# EasyEDA Pro project ProPrj_Embedded Tools_2024-11-02.epro, board Communication
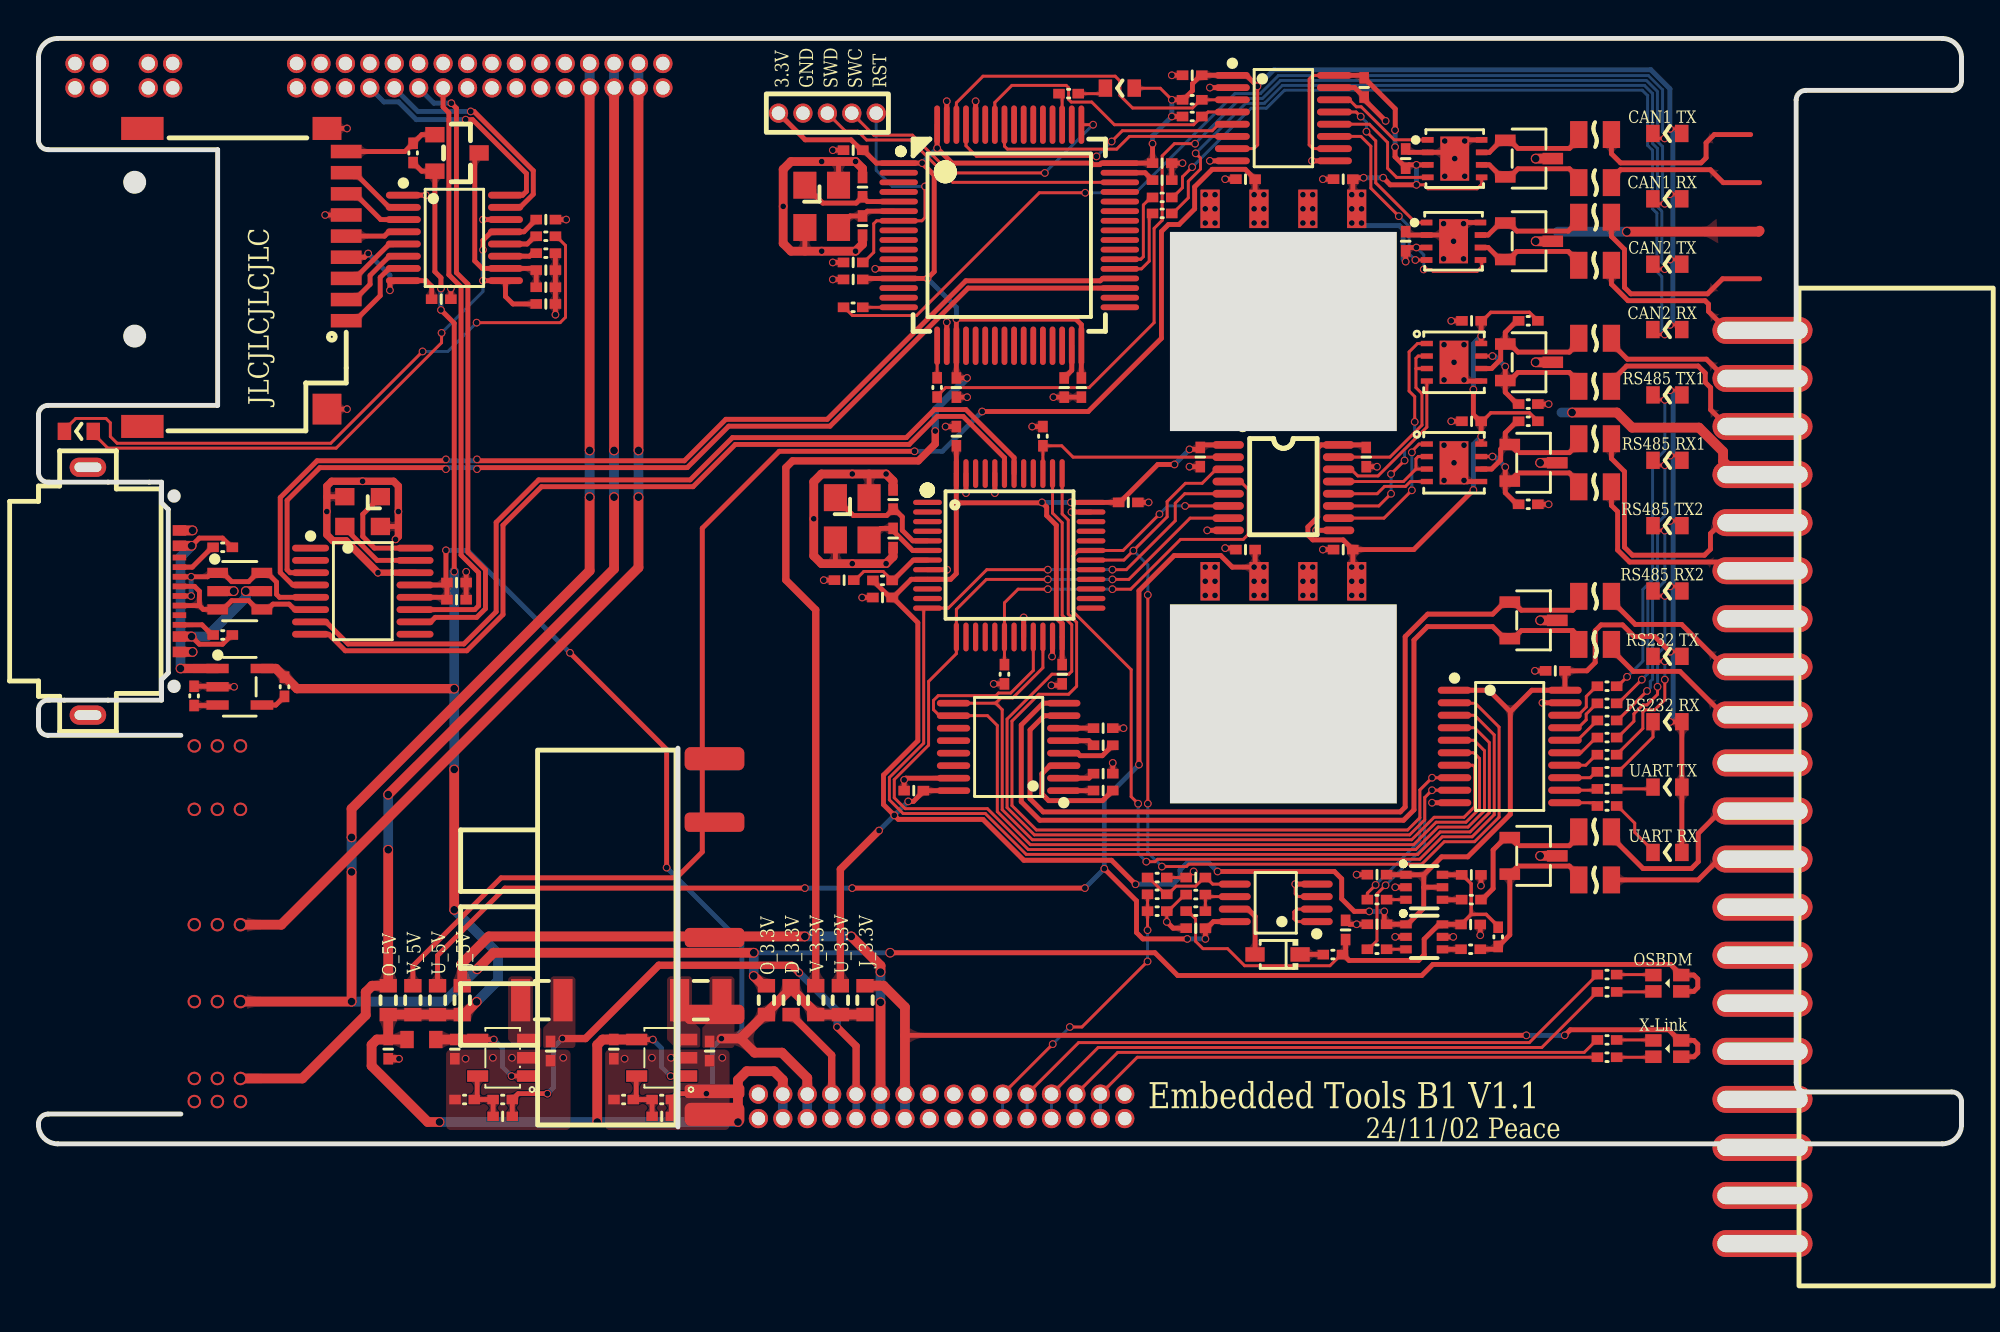
[diagram p11: board, top side]
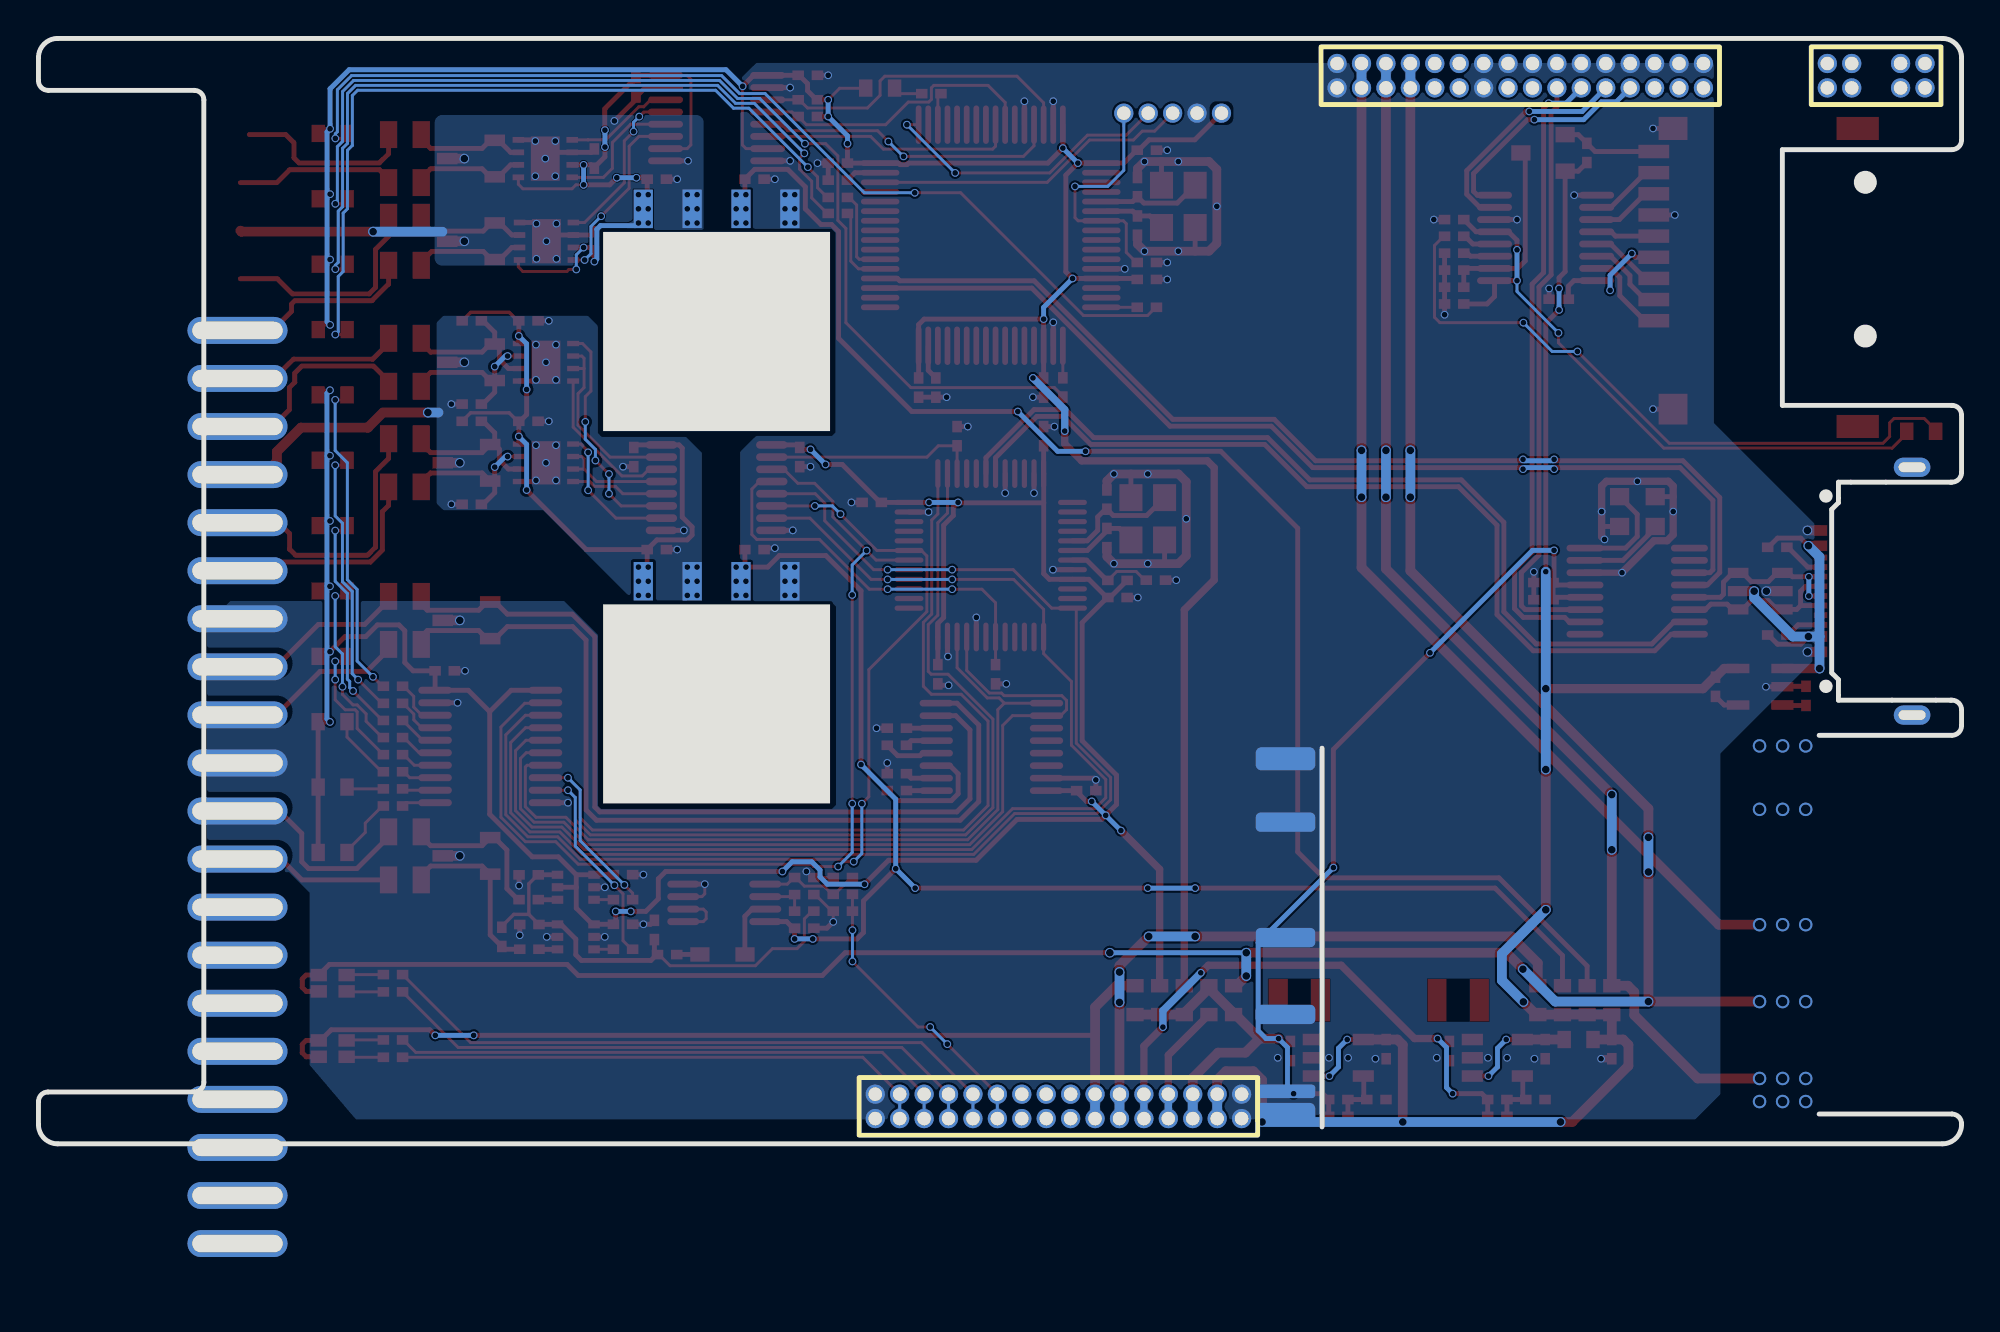
[diagram p12: board, bottom side, seen from below]

Outline 100 x 57.5 mm; copper layers: Top Layer, Bottom Layer. Coordinates in mm from the lower left corner of the outline.
Outline path: 7.4,21.25 0.5,21.25 arc(0.15,21.4) 0,21.75 0,22.58 arc(0.15,22.93) 0.5,23.08 0.57,23.08 ; 7.4,1.55 0.5,1.55 arc(0.15,1.4) 0,1.05 0,1 arc(0.29,0.29) 1,0 99,0 arc(99.71,0.29) 100,1 100,2.2 arc(99.85,2.55) 99.5,2.7 91.9,2.7 arc(91.55,2.85) 91.4,3.2 91.4,54.3 arc(91.55,54.65) 91.9,54.8 99.5,54.8 arc(99.85,54.95) 100,55.3 100,56.5 arc(99.71,57.21) 99,57.5 1,57.5 arc(0.29,57.21) 0,56.5 0,52.21 arc(0.15,51.86) 0.5,51.71 9.32,51.71 9.32,38.41 0.5,38.41 arc(0.15,38.27) 0,37.91 0,34.92 arc(0.15,34.57) 0.5,34.42 0.57,34.42
Stack: Top Layer 0.035mm / Dielectric1 1.51mm FR4 er 4.5 / Bottom Layer 0.035mm

## Design rules (mm)
template: 双面板
spacing copperThickness1oz (default): track to track 0.102, other pairs 0.102 to 0.201
spacing copperThickness2oz: track to track 0.203, other pairs 0.152 to 0.3
track width copperThickness1oz (default): min 0.102, default 0.254, max 2.54
track width copperThickness2oz: min 0.203, default 0.254, max 2.54
differential pair differentialPair (default): width min 0.127, default 0.254, max 2.54; gap min 0.152, default 0.152
via viaSize (default): diameter min 0.399, default 0.399, max 10; hole min 0.3, default 0.3, max 6.299

## Placement (name value [footprint] x y rotation side)
B1  600R@100MHz  [L0603]  19.91 5.43 0 top
C1  100nF  [C0402]  42.36 51.69 0 top
C2  2.2uF  [C0402]  47.73 39.34 270 top
C3  100nF  [C0402]  54.23 39.34 90 top
C4  100nF  [C0402]  58.43 51.02 180 top
C5  100nF  [C0402]  42.36 44.96 0 top
C6  2.2uF  [C0402]  58.43 50.13 180 top
C7  10pF  [C0402]  42.85 49.77 90 top
C8  10pF  [C0402]  42.85 47.77 90 top
C9  2.2uF  [C0402]  53.34 39.34 90 top
C10  100nF  [C0402]  42.36 45.85 180 top
C11  100nF  [C0402]  59.99 55.58 0 top
C12  100nF  [C0402]  71.09 51.25 90 top
C13  100nF  [C0402]  71.09 46.95 90 top
C14  100nF  [C0402]  68.94 54.95 270 top
C15  4.7uF  [C0402]  62.77 50.18 0 top
C16  10uF  [C0402]  67.85 50.18 0 top
C17  10pF  [C0402]  44.44 31.51 90 top
C18  10pF  [C0402]  44.44 33.51 90 top
C19  100nF  [C0402]  78.88 24.61 0 top
C20  100nF  [C0402]  43.89 28.42 0 top
C21  100nF  [C0402]  53.23 24.43 90 top
C22  100nF  [C0402]  41.89 29.32 0 top
C23  100nF  [C0402]  56.67 33.37 180 top
C24  100nF  [C0402]  47.73 36.81 270 top
C25  100nF  [C0402]  60.41 35.73 90 top
C26  4.7uF  [C0402]  62.77 30.91 0 top
C27  100nF  [C0402]  55.36 18.38 0 top
C28  100nF  [C0402]  55.36 19.26 0 top
C29  100nF  [C0402]  55.36 20.73 180 top
C30  100nF  [C0402]  55.36 21.62 0 top
C31  10uF  [C0402]  67.85 30.91 0 top
C32  100nF  [C0402]  60.18 13.85 0 top
C33  100nF  [C0402]  69.04 35.72 270 top
C34  100nF  [C0402]  69.6 14 0 top
C35  100nF  [C0402]  69.6 11.42 0 top
C36  100nF  [C0402]  45.52 18.37 180 top
C37  100nF  [C0402]  74.51 13.99 180 top
C38  100nF  [C0402]  74.47 11.41 180 top
C39  2.2uF  [C0402]  67.97 11.13 270 top
C40  100nF  [C0402]  74.52 42.81 180 top
C41  100nF  [C0402]  74.52 37.59 180 top
C42  100nF  [C0402]  60.18 11.22 180 top
C43  10uF  [C0402]  26.38 44.56 180 top
C44  100nF  [C0402]  26.38 45.45 0 top
C45  10uF  [C0402]  26.38 48.08 180 top
C46  100nF  [C0402]  26.38 43.69 0 top
C47  100nF  [C0402]  20.95 43.94 180 top
C48  10uF  [C0402]  21.74 29.2 180 top
C49  100nF  [C0402]  21.74 28.3 180 top
C50  100nF  [C0402]  18.19 4.93 90 top
C51  4.7uF  [C0402]  29.92 4.93 90 top
C52  4.7uF  [C0402]  21.65 4.93 90 top
C53  10pF  [C0402]  32.41 1.43 0 top
C54  10pF  [C0402]  24.14 1.43 0 top
C55  10uF  [C0402]  34.9 4.83 90 top
C56  10uF  [C0402]  26.63 4.83 90 top
CARD1  TF PUSH  [TF-SMD_TF-PUSH]  10.7 45.07 270 top
CN1  KF2EDGV-2.5-20P  [CONN-TH_20P-P2.50_KF2EDGV-2.5-20P_SMD]  89.5 28.75 0 top
D1  SM712  [SOT-23-3_L2.9-W1.6-P1.90-LS2.8-BR]  77.51 51.25 180 top
D2  SM712  [SOT-23-3_L2.9-W1.6-P1.90-LS2.8-BR]  77.51 46.95 180 top
D3  1N5819WS  [SOD-323_L1.8-W1.3-LS2.5-RD]  64.43 9.85 180 top
D4  USBLC6-2SC6  [SOT-23-6_L2.9-W1.6-P0.95-LS2.8-BL]  10.47 28.75 270 top
D5  -  [LED1615]  84.7 8.35 0 top
D6  -  [LED1615]  84.7 4.95 0 top
F1  fe1784bef1244946a9952536cf903c7f  [F0805]  80.94 52.5 0 top
F2  fe1784bef1244946a9952536cf903c7f  [F0805]  80.94 50 0 top
F3  fe1784bef1244946a9952536cf903c7f  [F0805]  80.94 48.2 0 top
F4  fe1784bef1244946a9952536cf903c7f  [F0805]  80.94 45.7 0 top
F5  fe1784bef1244946a9952536cf903c7f  [F0805]  80.94 25.98 0 top
F6  fe1784bef1244946a9952536cf903c7f  [F0805]  80.94 28.48 0 top
F7  fe1784bef1244946a9952536cf903c7f  [F0805]  80.94 16.23 0 top
F8  fe1784bef1244946a9952536cf903c7f  [F0805]  80.94 13.73 0 top
F9  fe1784bef1244946a9952536cf903c7f  [F0805]  80.94 39.41 0 top
F10  fe1784bef1244946a9952536cf903c7f  [F0805]  80.94 41.91 0 top
F11  fe1784bef1244946a9952536cf903c7f  [F0805]  80.94 34.18 0 top
F12  fe1784bef1244946a9952536cf903c7f  [F0805]  80.94 36.68 0 top
L1  2.2uH  [IND-SMD_L2.5-W2.0_MHCHL2520]  34.44 7.47 0 top
L2  2.2uH  [IND-SMD_L2.5-W2.0_MHCHL2520]  26.17 7.47 0 top
LED1  BLUE  [LED0603]  84.7 52.55 0 top
LED2  YELLOW  [LED0603]  84.7 49.15 0 top
LED3  BLUE  [LED0603]  84.7 45.75 0 top
LED4  YELLOW  [LED0603]  84.7 42.35 0 top
LED5  WHITE  [LED0603]  56.23 54.91 0 top
LED6  BLUE  [LED0603]  84.71 38.95 0 top
LED7  YELLOW  [LED0603]  84.71 35.55 0 top
LED8  BLUE  [LED0603]  84.71 32.15 0 top
LED9  YELLOW  [LED0603]  84.71 28.75 0 top
LED10  BLUE  [LED0603]  84.71 25.35 0 top
LED11  YELLOW  [LED0603]  84.71 21.95 0 top
LED12  BLUE  [LED0603]  84.71 18.55 0 top
LED13  YELLOW  [LED0603]  84.71 15.15 0 top
LED14  WHITE  [LED0603]  2.1 37.05 0 top
NOREF  -  [Pad_e1749]  68.55 29.27 0 top
NOREF#2  -  [Pad_e734]  66.01 48.64 0 top
NOREF#3  -  [Pad_e1746]  60.93 29.27 0 top
NOREF#4  -  [Pad_e735]  68.55 48.64 0 top
NOREF#5  -  [Pad_e1747]  63.47 29.27 0 top
NOREF#6  -  [Pad_e1748]  66.01 29.27 0 top
NOREF#7  -  [Pad_e733]  63.47 48.64 0 top
NOREF#8  -  [Pad_e732]  60.93 48.64 0 top
P1  dc5cb5f8908149b6a9bd9e7172c1ed3e  [HDR-TH_5P-P1.27-V-M]  41.02 53.61 0 top
P2  BX-PM1.27-2-5PU  [HDR-TH_10P-P1.27-V-F-R2-C5-S1.27_1]  4.44 55.56 0 bottom
P3  27a93d4c6a1a4b3c8a68780d97aa3357  [HDR-TH_32P-P1.27-V-F-R2-C16-S1.27]  46.96 1.95 0 bottom
P4  27a93d4c6a1a4b3c8a68780d97aa3357  [HDR-TH_32P-P1.27-V-F-R2-C16-S1.27]  22.95 55.56 0 bottom
Q1  AO3401A  [SOT-23_L2.9-W1.3-P1.90-LS2.4-BR]  21.76 51.55 180 top
R1  1K  [R0402]  42.36 43.52 180 top
R2  1K  [R0402]  46.73 39.35 270 top
R3  1K  [R0402]  58.43 48.4 0 top
R4  1K  [R0402]  58.43 49.23 0 top
R5  1K  [R0402]  53.57 54.63 0 top
R6  100K  [R0402]  59.99 54.31 180 top
R7  100K  [R0402]  59.99 53.44 180 top
R8  10K  [R0402]  43.89 29.31 180 top
R9  1K  [R0402]  81.57 23.8 180 top
R10  1K  [R0402]  81.57 22.91 180 top
R11  1K  [R0402]  81.57 22.02 180 top
R12  1K  [R0402]  81.57 21.13 180 top
R13  1K  [R0402]  81.57 20.24 180 top
R14  1K  [R0402]  81.57 19.35 180 top
R15  1K  [R0402]  81.57 18.46 180 top
R16  1K  [R0402]  81.57 17.57 180 top
R17  100K  [R0402]  52.23 36.81 270 top
R18  100K  [R0402]  50.23 24.43 90 top
R19  1K  [R0402]  58.17 12.1 0 top
R20  10K  [R0402]  58.17 12.98 0 top
R21  100K  [R0402]  58.17 13.85 0 top
R22  220R  [R0402]  69.6 12.7 0 top
R23  220R  [R0402]  69.6 10.12 0 top
R24  10K  [R0402]  60.18 12.1 0 top
R25  10K  [R0402]  60.18 12.97 180 top
R26  100R  [R0402]  74.51 12.7 0 top
R27  100R  [R0402]  74.47 10.12 0 top
R28  100R  [R0402]  67.31 9.85 180 top
R29  10K  [R0402]  75.9 10.77 270 top
R30  10K  [R0402]  77.47 42.81 0 top
R31  10K  [R0402]  77.47 38.48 180 top
R32  10K  [R0402]  77.47 37.59 0 top
R33  10K  [R0402]  77.47 33.27 180 top
R34  100K  [R0402]  19.48 51.55 270 top
R35  1K  [R0402]  26.38 46.33 0 top
R36  1K  [R0402]  26.38 47.21 0 top
R37  100K  [R0402]  32.41 2.31 0 top
R38  22K  [R0402]  30.43 2.31 0 top
R39  200K  [R0402]  24.14 2.31 0 top
R40  100K  [R0402]  22.16 2.31 0 top
R41  56K  [R0402]  9.58 26.47 180 top
R42  56K  [R0402]  9.58 31.03 180 top
R43  100K  [R0402]  12.79 23.78 90 top
R44  12K  [R0402]  8.09 23.3 270 top
R45  0R  [R0603]  19.47 7.47 270 top
R46  0R  [R0603]  40.42 7.47 270 top
R47  0R  [R0603]  20.75 7.47 270 top
R48  0R  [R0603]  41.7 7.47 270 top
R49  0R  [R0603]  18.19 7.47 270 top
R50  0R  [R0603]  37.86 7.47 270 top
R51  0R  [R0603]  22.03 7.47 270 top
R52  0R  [R0603]  42.98 7.47 270 top
R53  0R  [R0603]  39.14 7.47 90 top
R54  1K  [R0402]  81.57 7.9 180 top
R55  1K  [R0402]  81.57 8.81 180 top
R56  1K  [R0402]  81.57 4.5 180 top
R57  1K  [R0402]  81.57 5.41 180 top
SW1  SS23H37L4  [SW-TH_SS23H37LX_SMD]  9.3 11.4 0 top
U1  SIT1057TK/3  [DFN-8_L3.0-W3.0-P0.65-BL-EP-1]  73.65 51.25 270 top
U2  SIT1057TK/3  [DFN-8_L3.0-W3.0-P0.65-BL-EP-1]  73.58 46.95 270 top
U3  CA-IS3742HB  [SSOP-16_L4.9-W3.9-P0.64-LS6.0-BL]  64.74 53.36 270 top
U4  B0505S-1WR3  [PWRM-TH_B0503S-1WR2_S_1]  64.74 47.49 0 top
U5  74HC245KAJ  [TSSOP-20_L6.5-W4.4-P0.65-LS6.4-BL]  76.5 20.67 270 top
U6  CH344Q  [LQFP-48_L7.0-W7.0-P0.50-LS9.0-BL]  50.48 30.62 270 top
U7  CA-IS3762HB  [SSOP-16_L4.9-W3.9-P0.64-LS6.0-BL-1]  64.74 34.13 270 top
U8  B0505S-1WR3  [PWRM-TH_B0503S-1WR2_S_1]  64.74 28.11 0 top
U9  SP3232EEY-L/TR  [TSSOP-16_L5.0-W4.4-P0.65-LS6.4-BL]  50.45 20.65 90 top
U10  74LVC1T45DW-7  [SC-70-6_L2.2-W1.3-P0.65-LS2.1-BR]  72.06 13.35 180 top
U11  74LVC1T45DW-7  [SC-70-6_L2.2-W1.3-P0.65-LS2.1-BR]  72.06 10.77 180 top
U12  SIT3088ETK  [DFN-8_L3.0-W3.0-P0.65-BL-EP]  73.61 40.66 270 top
U13  SIT3088ETK  [DFN-8_L3.0-W3.0-P0.65-BL-EP]  73.61 35.43 270 top
U14  SDT23C712L02  [SOT-23-3_L2.9-W1.6-P1.90-LS2.8-BR]  77.74 27.23 180 top
U15  ESDA5V3L  [SOT-23-3_L2.9-W1.6-P1.90-LS2.8-BR]  77.74 14.98 180 top
U16  SM712  [SOT-23-3_L2.9-W1.6-P1.90-LS2.8-BR]  77.51 40.66 180 top
U17  SM712  [SOT-23-3_L2.9-W1.6-P1.90-LS2.8-BR]  77.74 35.43 180 top
U18  GL823K-HCY04  [SSOP-16_L4.9-W3.9-P0.64-LS6.0-BL]  21.63 47.13 270 top
U19  CH334R  [QSOP-16_L4.9-W3.9-P0.64-LS6.0-BL]  16.87 28.75 270 top
U20  TLV62568DBVR  [SOT-23-5_L3.0-W1.7-P0.95-LS2.8-BR]  32.41 4.48 0 top
U21  TLV62568DBVR  [SOT-23-5_L3.0-W1.7-P0.95-LS2.8-BR]  24.14 4.48 0 top
U22  SY6280AAC  [SOT-23-5_L3.0-W1.7-P0.95-LS2.8-BL]  10.47 23.78 270 top
U23  STM32F405RGT6  [LQFP-64_L10.0-W10.0-P0.50-LS12.0-BL]  50.48 47.27 270 top
U24  LMV358AIDGKR  [VSSOP-8_L3.0-W3.0-P0.65-LS5.0-BL]  64.34 12.54 90 top
USB1  USB31-TYPEC-16X7C-1FS  [USB-SMD_USB31-TYPEC-16X7C-1FS]  4.95 28.75 270 top
X1  8MHz  [CRYSTAL-SMD_4P-L3.2-W2.5-BL-A]  40.73 48.77 270 top
X2  8MHz  [CRYSTAL-SMD_4P-L3.2-W2.5-BL-A]  42.32 32.51 270 top
X3  12MHz  [CRYSTAL-SMD_4P-L2.5-W2.0-BL-A]  16.85 32.89 180 top

## Footprints (pads in the part's own frame, mm; a bottom-side part is the same pattern mirrored in y, then rotated)
C0402
  rect 0.6x0.5 smd: 1(-0.5,0) 2(0.5,0)
CONN-TH_20P-P2.50_KF2EDGV-2.5-20P_SMD
  oval 5.2x1.4 hole 4.7x0.9: 1(0.15,13.563) 2(0.15,11.063) 3(0.15,8.563) 4(0.15,6.063) 5(0.15,3.563) 6(0.15,1.063) 7(0.15,-1.437) 8(0.15,-3.937) 9(0.15,-6.437) 10(0.15,-8.937) 11(0.15,-11.437) 12(0.15,-13.937) 13(0.15,-16.437) 14(0.15,-18.937) 15(0.15,-21.437) 16(0.15,-23.937) 17(0.15,-26.437) 18(0.15,-28.937) 19(0.15,-31.437) 20(0.15,-33.937)
CRYSTAL-SMD_4P-L2.5-W2.0-BL-A
  rect 1x0.9 smd: 1(-0.925,-0.775) 2(0.925,-0.775) 3(0.925,0.775) 4(-0.925,0.775)
CRYSTAL-SMD_4P-L3.2-W2.5-BL-A
  rect 1.4x1.2 smd: 1(-1.1,-0.875) 2(1.1,-0.875) 3(1.1,0.875) 4(-1.1,0.875)
DFN-8_L3.0-W3.0-P0.65-BL-EP
  rect 0.28x0.625 smd: 1(-0.975,-1.413) 2(-0.325,-1.413) 3(0.325,-1.413) 4(0.975,-1.413) 5(0.975,1.413) 6(0.325,1.413) 7(-0.325,1.413) 8(-0.975,1.413)
  rect 2.25x1.5 smd: 9(0,0)
DFN-8_L3.0-W3.0-P0.65-BL-EP-1
  rect 0.3x0.6 smd: 1(-0.975,-1.4) 2(-0.325,-1.4) 3(0.325,-1.4) 4(0.975,-1.4) 5(0.975,1.4) 6(0.325,1.4) 7(-0.325,1.4) 8(-0.975,1.4)
  rect 2.3x1.5 smd: 9(0,0)
F0805
  rect 0.9x1.4 smd: 1(-0.85,0) 2(0.85,0)
HDR-TH_5P-P1.27-V-M
  rrect 1x1 hole 0.7: 1(-2.54,0)
  round 1 hole 0.7: 2(-1.27,0) 3(0,0) 4(1.27,0) 5(2.54,0)
HDR-TH_10P-P1.27-V-F-R2-C5-S1.27_1
  rrect 1x1 hole 0.7: 1(-2.54,-0.635)
  round 1 hole 0.7: 2(-2.54,0.635) 3(-1.27,-0.635) 4(-1.27,0.635) 7(1.27,-0.635) 8(1.27,0.635) 9(2.54,-0.635) 10(2.54,0.635)
HDR-TH_32P-P1.27-V-F-R2-C16-S1.27
  rrect 1x1 hole 0.7: 1(-9.525,-0.635)
  round 1 hole 0.7: 2(-9.525,0.635) 3(-8.255,-0.635) 4(-8.255,0.635) 5(-6.985,-0.635) 6(-6.985,0.635) 7(-5.715,-0.635) 8(-5.715,0.635) 9(-4.445,-0.635) 10(-4.445,0.635) 11(-3.175,-0.635) 12(-3.175,0.635) 13(-1.905,-0.635) 14(-1.905,0.635) 15(-0.635,-0.635) 16(-0.635,0.635) 17(0.635,-0.635) 18(0.635,0.635) 19(1.905,-0.635) 20(1.905,0.635) 21(3.175,-0.635) 22(3.175,0.635) 23(4.445,-0.635) 24(4.445,0.635) 25(5.715,-0.635) 26(5.715,0.635) 27(6.985,-0.635) 28(6.985,0.635) 29(8.255,-0.635) 30(8.255,0.635) 31(9.525,-0.635) 32(9.525,0.635)
IND-SMD_L2.5-W2.0_MHCHL2520
  rect 1x2.2 smd: 1(-1.1,0) 2(1.1,0)
L0603
  rect 0.7x0.9 smd: 1(-0.75,0) 2(0.75,0)
LED0603
  rect 0.7x0.9 smd: 1(-0.75,0.008) 2(0.75,0.008)
LED1615
  rect 0.85x0.65 smd: 1(-0.725,0.425) 2(-0.725,-0.425) 3(0.725,-0.425) 4(0.725,0.425)
LQFP-48_L7.0-W7.0-P0.50-LS9.0-BL
  oval 0.27x1.5 smd: 1(-2.75,-4.25) 2(-2.25,-4.25) 3(-1.75,-4.25) 4(-1.25,-4.25) 5(-0.75,-4.25) 6(-0.25,-4.25) 7(0.25,-4.25) 8(0.75,-4.25) 9(1.25,-4.25) 10(1.75,-4.25) 11(2.25,-4.25) 12(2.75,-4.25) 25(2.75,4.25) 26(2.25,4.25) 27(1.75,4.25) 28(1.25,4.25) 29(0.75,4.25) 30(0.25,4.25) 31(-0.25,4.25) 32(-0.75,4.25) 33(-1.25,4.25) 34(-1.75,4.25) 35(-2.25,4.25) 36(-2.75,4.25)
  oval 1.5x0.27 smd: 13(4.25,-2.75) 14(4.25,-2.25) 15(4.25,-1.75) 16(4.25,-1.25) 17(4.25,-0.75) 18(4.25,-0.25) 19(4.25,0.25) 20(4.25,0.75) 21(4.25,1.25) 22(4.25,1.75) 23(4.25,2.25) 24(4.25,2.75) 37(-4.25,2.75) 38(-4.25,2.25) 39(-4.25,1.75) 40(-4.25,1.25) 41(-4.25,0.75) 42(-4.25,0.25) 43(-4.25,-0.25) 44(-4.25,-0.75) 45(-4.25,-1.25) 46(-4.25,-1.75) 47(-4.25,-2.25) 48(-4.25,-2.75)
LQFP-64_L10.0-W10.0-P0.50-LS12.0-BL
  oval 0.3x2 smd: 1(-3.75,-5.75) 2(-3.25,-5.75) 3(-2.75,-5.75) 4(-2.25,-5.75) 5(-1.75,-5.75) 6(-1.25,-5.75) 7(-0.75,-5.75) 8(-0.25,-5.75) 9(0.25,-5.75) 10(0.75,-5.75) 11(1.25,-5.75) 12(1.75,-5.75) 13(2.25,-5.75) 14(2.75,-5.75) 15(3.25,-5.75) 16(3.75,-5.75) 33(3.75,5.75) 34(3.25,5.75) 35(2.75,5.75) 36(2.25,5.75) 37(1.75,5.75) 38(1.25,5.75) 39(0.75,5.75) 40(0.25,5.75) 41(-0.25,5.75) 42(-0.75,5.75) 43(-1.25,5.75) 44(-1.75,5.75) 45(-2.25,5.75) 46(-2.75,5.75) 47(-3.25,5.75) 48(-3.75,5.75)
  oval 2x0.3 smd: 17(5.75,-3.75) 18(5.75,-3.25) 19(5.75,-2.75) 20(5.75,-2.25) 21(5.75,-1.75) 22(5.75,-1.25) 23(5.75,-0.75) 24(5.75,-0.25) 25(5.75,0.25) 26(5.75,0.75) 27(5.75,1.25) 28(5.75,1.75) 29(5.75,2.25) 30(5.75,2.75) 31(5.75,3.25) 32(5.75,3.75) 49(-5.75,3.75) 50(-5.75,3.25) 51(-5.75,2.75) 52(-5.75,2.25) 53(-5.75,1.75) 54(-5.75,1.25) 55(-5.75,0.75) 56(-5.75,0.25) 57(-5.75,-0.25) 58(-5.75,-0.75) 59(-5.75,-1.25) 60(-5.75,-1.75) 61(-5.75,-2.25) 62(-5.75,-2.75) 63(-5.75,-3.25) 64(-5.75,-3.75)
Pad_e732
  rect 1x2 smd far side: 1(0,0)
Pad_e733
  rect 1x2 smd far side: 1(0,0)
Pad_e734
  rect 1x2 smd far side: 1(0,0)
Pad_e735
  rect 1x2 smd far side: 1(0,0)
Pad_e1746
  rect 1x2 smd far side: 1(0,0)
Pad_e1747
  rect 1x2 smd far side: 1(0,0)
Pad_e1748
  rect 1x2 smd far side: 1(0,0)
Pad_e1749
  rect 1x2 smd far side: 1(0,0)
PWRM-TH_B0503S-1WR2_S_1
  rect 1x2 smd: 1(-3.81,1.15) 2(-1.27,1.15) 3(1.27,1.15) 4(3.81,1.15)
QSOP-16_L4.9-W3.9-P0.64-LS6.0-BL
  oval 0.35x1.921 smd: 1(-2.24,-2.716) 2(-1.6,-2.716) 3(-0.96,-2.716) 4(-0.32,-2.716) 5(0.32,-2.716) 6(0.96,-2.716) 7(1.6,-2.716) 8(2.24,-2.716) 9(2.24,2.716) 10(1.6,2.716) 11(0.96,2.716) 12(0.32,2.716) 13(-0.32,2.716) 14(-0.96,2.716) 15(-1.6,2.716) 16(-2.24,2.716)
R0402
  rect 0.6x0.5 smd: 1(-0.5,0) 2(0.5,0)
R0603
  rect 0.7x0.9 smd: 1(-0.75,0) 2(0.75,0)
SC-70-6_L2.2-W1.3-P0.65-LS2.1-BR
  rect 0.6x0.42 smd: 1(0.95,-0.65) 2(0.95,0) 3(0.95,0.65) 4(-0.95,0.65) 5(-0.95,0) 6(-0.95,-0.65)
SOD-323_L1.8-W1.3-LS2.5-RD
  rect 1x0.75 smd: 1(-1.173,0) 2(1.173,0)
SOT-23-3_L2.9-W1.6-P1.90-LS2.8-BR
  rect 1.07x0.6 smd: 1(1.235,-0.95) 2(1.235,0.95) 3(-1.235,0)
SOT-23-5_L3.0-W1.7-P0.95-LS2.8-BL
  rect 0.49x1.157 smd: 1(-0.95,-1.153) 2(0,-1.153) 3(0.95,-1.153)
  rect 0.49x1.175 smd: 4(0.95,1.153) 5(-0.95,1.153)
SOT-23-5_L3.0-W1.7-P0.95-LS2.8-BR
  rect 1.1x0.6 smd: 1(1.3,-0.95) 2(1.3,0) 3(1.3,0.95) 4(-1.3,0.95) 5(-1.3,-0.95)
SOT-23-6_L2.9-W1.6-P0.95-LS2.8-BL
  rect 0.532x1.072 smd: 1(-0.95,-1.149) 2(0,-1.149) 3(0.95,-1.149) 4(0.95,1.149) 5(0,1.149) 6(-0.95,1.149)
SOT-23_L2.9-W1.3-P1.90-LS2.4-BR
  rect 1x0.8 smd: 1(1.15,-0.95) 2(1.15,0.95) 3(-1.15,0)
SSOP-16_L4.9-W3.9-P0.64-LS6.0-BL
  oval 0.355x1.815 smd: 1(-2.223,-2.655) 2(-1.587,-2.655) 3(-0.953,-2.655) 4(-0.318,-2.655) 5(0.318,-2.655) 6(0.953,-2.655) 7(1.587,-2.655) 8(2.223,-2.655) 9(2.223,2.655) 10(1.587,2.655) 11(0.953,2.655) 12(0.318,2.655) 13(-0.318,2.655) 14(-0.953,2.655) 15(-1.587,2.655) 16(-2.223,2.655)
SSOP-16_L4.9-W3.9-P0.64-LS6.0-BL-1
  oval 0.4x1.63 smd: 1(-2.223,-2.87) 2(-1.587,-2.87) 3(-0.953,-2.87) 4(-0.318,-2.87) 5(0.318,-2.87) 6(0.953,-2.87) 7(1.587,-2.87) 8(2.223,-2.87) 9(2.223,2.87) 10(1.587,2.87) 11(0.953,2.87) 12(0.318,2.87) 13(-0.318,2.87) 14(-0.953,2.87) 15(-1.587,2.87) 16(-2.223,2.87)
SW-TH_SS23H37LX_SMD
  rrect 3.1x1 smd far side: 1(25.85,5.331) 2(25.85,-0.669) 3(25.85,-4.669)
  rrect 3.1x0.7 smd far side: 4(25.85,-8.669)
  rrect 3.1x0.7 smd: 5(25.85,-8.669)
  rrect 3.1x1 smd: 6(25.85,-4.669) 7(25.85,-0.669) 8(25.85,5.331)
  rrect 3.1x1.2 smd: 9(25.85,8.631) 10(25.85,-9.869)
  rrect 3.1x1.2 smd far side: 11(25.85,-9.869) 12(25.85,8.631)
TF-SMD_TF-PUSH
  rect 0.7x1.6 smd: 1(2.25,5.3) 2(1.15,5.3) 3(0.05,5.3) 4(-1.05,5.3) 5(-2.15,5.3) 6(-3.25,5.3) 7(-4.35,5.3) 8(-5.45,5.3) CD(-6.55,5.3)
  rect 1.2x1.5 smd: 10(-7.75,4.3)
  rect 1.2x2.2 smd: 11(-7.75,-5.3) 12(7.75,-5.3)
  rect 1.6x1.5 smd: 13(6.85,4.3)
TSSOP-16_L5.0-W4.4-P0.65-LS6.4-BL
  oval 0.343x1.732 smd: 1(-2.275,-2.866) 2(-1.625,-2.866) 3(-0.975,-2.866) 4(-0.325,-2.866) 5(0.325,-2.866) 6(0.975,-2.866) 7(1.625,-2.866) 8(2.275,-2.866) 9(2.275,2.866) 10(1.625,2.866) 11(0.975,2.866) 12(0.325,2.866) 13(-0.325,2.866) 14(-0.975,2.866) 15(-1.625,2.866) 16(-2.275,2.866)
TSSOP-20_L6.5-W4.4-P0.65-LS6.4-BL
  oval 0.364x1.742 smd: 1(-2.925,-2.871) 2(-2.275,-2.871) 3(-1.625,-2.871) 4(-0.975,-2.871) 5(-0.325,-2.871) 6(0.325,-2.871) 7(0.975,-2.871) 8(1.625,-2.871) 9(2.275,-2.871) 10(2.925,-2.871) 11(2.925,2.871) 12(2.275,2.871) 13(1.625,2.871) 14(0.975,2.871) 15(0.325,2.871) 16(-0.325,2.871) 17(-0.975,2.871) 18(-1.625,2.871) 19(-2.275,2.871) 20(-2.925,2.871)
USB-SMD_USB31-TYPEC-16X7C-1FS
  rect 0.55x0.7 smd: 1(-3.16,2.38) 2(-2.36,2.38) 11(2.36,2.38) 12(3.16,2.38)
  rect 0.3x0.7 smd: 3(-1.75,2.38) 4(-1.25,2.38) 5(-0.75,2.38) 6(-0.25,2.38) 7(0.25,2.38) 8(0.75,2.38) 9(1.25,2.38) 10(1.75,2.38)
  oval 1x1.9 hole 0.5x1.4: 13(-6.445,-2.38) 16(6.445,-2.38)
VSSOP-8_L3.0-W3.0-P0.65-LS5.0-BL
  oval 0.364x1.662 smd: 1(-0.975,-2.131) 2(-0.325,-2.131) 3(0.325,-2.131) 4(0.975,-2.131) 5(0.975,2.131) 6(0.325,2.131) 7(-0.325,2.131) 8(-0.975,2.131)

## Nets
As in the schematic, except:
GND: C1.1 C2.2 C3.1 C4.1 C5.1 C6.1 C7.2 C8.1 C9.1 C10.2 C11.1 C15.1 C17.1 C18.2 C19.1 C20.1 C21.1 C22.1 C23.1 C24.1 C25.1 C26.1 C28.2 C30.2 C32.1 C34.1 C35.1 C36.2 C37.1 C38.1 C39.1 C42.2 C43.1 C44.2 C45.1 C46.2 C47.1 C48.1 C49.1 C50.1 C51.1 C52.1 C55.1 C56.1 CARD1.6 CARD1.10 CARD1.13 CN1.11 CN1.14 D4.2 NOREF#3.1 NOREF#8.1 P1.2 P3.1 P3.2 P3.31 P3.32 P4.1 P4.3 P4.5 P4.7 P4.9 P4.11 P4.13 P4.15 P4.17 P4.19 P4.20 P4.31 P4.32 R17.1 R18.1 R19.2 R21.2 R25.2 R35.2 R38.1 R40.1 R44.1 U3.2 U3.8 U4.1 U5.10 U5.19 U6.8 U6.20 U6.23 U6.35 U6.44 U6.47 U7.8 U8.1 U9.15 U10.2 U11.2 U11.5 U14.3 U15.3 U18.1 U18.14 U19.14 U20.2 U21.2 U22.2 U23.12 U23.18 U23.60 U23.63 U24.3 U24.4 USB1.1 USB1.12 X1.2 X1.4 X2.2 X2.4 X3.2 X3.4
CAN1_H: CN1.1 F1.2
CAN1_L: CN1.2 F2.2
CAN2_H: CN1.4 F3.2
CAN2_L: CN1.5 F4.2
CAN_5V: C12.1 C13.1 C14.1 C16.2 NOREF#4.1 U1.3 U1.5 U2.3 U2.5 U3.10 U3.16 U4.4
CAN_G: C12.2 C13.2 C14.2 C16.1 CN1.3 D1.3 D2.3 NOREF#2.1 U1.2 U1.8 U1.9 U2.2 U2.8 U2.9 U3.9 U3.15 U4.3
RS232_RXD: CN1.13 F5.2
RS232_TXD: CN1.12 F6.2
RS485_5V: C31.2 C33.1 C40.1 C41.1 NOREF.1 R30.2 R32.2 U7.16 U8.4 U12.8 U13.8
RS485_A1: CN1.6 F10.2
RS485_A2: CN1.9 F12.2
RS485_B1: CN1.7 F9.2
RS485_B2: CN1.10 F11.2
RS485_G: C31.1 C33.2 C40.2 C41.2 CN1.8 NOREF#6.1 R31.1 R33.1 U7.9 U8.3 U12.5 U12.9 U13.5 U13.9 U16.3 U17.3
U_5V: C26.2 C42.1 NOREF#5.1 R47.1 U8.2 U24.8
UART_RXD: CN1.16 F8.2
UART_TXD: CN1.15 F7.2
V_3.3V: C1.2 C2.1 C3.2 C4.2 C5.2 C11.2 LED1.2 LED2.2 LED3.2 LED4.2 LED5.2 P1.1 R6.2 R7.2 R46.1 U3.1 U3.7 U23.1 U23.13 U23.19 U23.32 U23.48 U23.64
V_5V: C15.2 NOREF#7.1 R45.1 U4.2
V_RST: C10.1 P1.5 U23.7
V_SWC: P1.4 U23.49
V_SWD: P1.3 U23.46

Pads without a net: CARD1 11 12; CN1 17 18 19 20; P3 15 16 17 18 19 20; P4 16 18 21 22 23 24; SW1 1 8 9 10 11 12; U6 1 2 3 4 10 11 14 15 16 17 19 25 26 27 28 29 32 33 34 40 41 45 46; U9 11 12 13 14; U19 1 2 9; U23 2 3 4 8 9 10 11 14 15 20 21 22 23 24 25 26 27 28 29 30 33 34 39 40 41 42 43 44 45 50 52 53 54 55 56 59; USB1 3 9 13 16

## Via types
v1: diameter 0.7, hole 0.5, Top Layer to Bottom Layer, 18 vias
v2: diameter 0.5, hole 0.4, Top Layer to Bottom Layer, 41 vias
v3: diameter 0.4, hole 0.3, Top Layer to Bottom Layer, 302 vias
v4: diameter 0.399, hole 0.299, Top Layer to Bottom Layer, 2 vias

## Routing (per net, layer and track width the routed paths; a pad name or vN(x,y) marks a point on that pad's centre or on a via; arc(x,y) is an arc through that point)
3.3V: length 61
  Top Layer w0.254: U19.12 21.11,28.43 C49.2 C48.2 ; C48.2 21.19,29.25 v3(21.19,30.87) ; C48.2 21.11,29.07 U19.13 ; v3(32.66,14.37) 32.66,20.52 v3(27.64,25.54) ; C53.2 R37.2 33.21,2.61 v3(34.73,2.61)
  Top Layer w0.508: R52.2 R48.2 R46.2 40.33,6.81 40.33,6.89 39.14,8.08 ; 36.51,5.48 v3(35.51,5.48) ; 36.51,5.48 37.76,6.72 R50.2 37.94,6.81 37.94,6.89 39.14,8.08 ; 36.51,5.48 37.24,4.74 38.66,4.74 39.98,3.42 P3.5 ; 39.14,8.08 R53.2
  Bottom Layer w0.254: v3(34.73,2.61) 35.05,2.93 35.05,5.01 v3(35.51,5.48) 36.17,5.48 36.58,5.89 36.58,10.46 v3(32.66,14.37) ; v3(27.64,25.54) 22.31,30.87 v3(21.19,30.87)
  Bottom Layer w0.508: P3.6 P3.5
5V: length 103.2
  Top Layer w0.254: v3(32.87,3.53) U20.1 ; v3(20.93,43.38) 21.62,42.69 v3(21.62,29.76) ; R34.2 19.93,50.59 Q1.2 20.61,45.37 20.93,45.05 v3(20.93,44.49) ; 31.95,5.42 31.11,5.42
  Top Layer w0.482: v2(21.62,23.68) 13.44,23.68 12.85,24.28 R43.2 12.34,24.73 11.62,24.73
  Top Layer w0.508: R51.2 R47.2 R45.2 R49.2 C50.2 ; P3.3 38.71,3.32 38.25,3.78 36.83,3.78 36.37,3.32 v2(36.37,1.14) ; v2(20.85,1.14) 20.24,1.14 17.32,4.06 17.32,5.15 17.6,5.43 C50.2 ; C50.2 B1.1 ; 22.12,6.72 v2(22.78,7.38) ; 31.11,5.42 C51.2 29.34,5.43 29.06,5.15 v2(29.06,1.14) ; v2(21.62,19.47) v2(21.62,12.17)
  Bottom Layer w0.254: v3(31.95,5.43) 32.4,4.97 32.4,4 v3(32.87,3.53) ; v3(20.93,44.49) v3(20.93,43.38)
  Bottom Layer w0.508: v2(36.37,1.14) v2(20.85,1.14) ; v2(22.78,7.38) 23.9,8.5 23.9,9.89 v2(21.62,12.17) ; P3.4 P3.3 ; v3(21.62,29.76) v2(21.62,23.68) v2(21.62,19.47)
GND: length 111.6
  Top Layer w0.152: R25.2 59.61,12.97 58.75,12.1 R19.2 v3(58.67,11.55) ; U24.3 65.5,12.86 65.35,13.01 v3(65.35,13.51) ; v3(60.07,14.17) 59.75,13.85 C32.1 ; R21.2 59.68,13.85
  Top Layer w0.254: U23.63 v3(47.23,54.23) ; C3.1 C9.1 v3(52.78,38.84) ; X2.2 41.44,30.18 ; v3(74.97,10.85) C38.1 ; U9.15 45.11,19.02 v3(45.02,18.93) C36.2 ; v3(58.67,11.55) 59,11.22 C42.2 ; X3.4 18.71,32.11 ; v3(20.14,49.35) U18.1 ; U6.44 v3(49.73,33.85) ; U6.8 v3(47.25,29.87) ; v3(60.77,31.91) U7.8 ; v3(10.17,23.78) U22.2 9.29,23.8 R44.1 ; U23.60 v3(48.73,54.23) ; C26.1 62.19,30.99 v3(61.71,30.99) ; v3(72.47,17.74) 73.63,17.74 ; v3(48.29,38.84) C2.2 ; v3(16.04,38.22) CARD1.13 ; v3(42.83,28.42) C20.1 ; v3(22.24,29.76) C48.1 C49.1 ; v3(70.55,13.35) U10.2 ; v3(56.42,21.62) C30.2 ; v3(52.67,23.85) 53.16,23.85 C21.1 ; v3(59.49,51.02) C4.1 C6.1 ; v3(68.54,14) C34.1 ; X3.2 14.99,33.67 ; v3(40.84,29.32) C22.1 ; v3(78.21,22.94) U5.19 ; C35.1 v3(68.54,11.42) 68.17,11.42 C39.1 ; X1.2 39.85,46.43 ; v3(21.45,44.49) C47.1 ; v3(75.01,13.43) C37.1 ; v3(14.91,48.32) CARD1.6 ; v3(41.31,45.85) C10.2 ; v3(59.86,35.23) C25.1 ; v3(60.91,54.94) U3.2 ; v3(52.71,25.35) 52.73,25.38 U6.23 ; U23.12 v3(43.51,45.52) ; R35.2 C44.2 C43.1 C46.2 v3(26.88,43.13) ; v3(49.67,23.93) R18.1 ; U6.35 v3(53.72,32.87) ; v3(16.04,52.82) CARD1.10 ; v3(57.73,33.37) C23.1 ; v3(23.12,48.08) U18.14 ; U6.20 v3(51.23,27.38) ; U23.18 v3(47.23,42.73) ; v3(58.94,55.58) C11.1 ; v3(47.17,37.31) C24.1 ; v3(55.86,19.82) C28.2 ; v3(73.57,10.77) 73.01,10.77 ; U6.47 v3(48.23,33.85) ; v3(27.44,48.08) C45.1 ; v3(51.67,37.31) R17.1 ; v3(70.55,10.77) U11.2 ; v3(65.35,13.51) U24.4 ; v3(41.31,44.96) C5.1 ; v3(61.71,50.18) C15.1 ; v3(77.82,24.61) C19.1 ; v3(60.91,51.13) U3.8 ; X1.4 41.6,51.1 ; 43.19,33.61 43.19,34.84 ; v3(41.31,51.69) C1.1
  Top Layer w0.33: v3(17.66,29.71) U19.14
  Top Layer w0.381: v3(17.66,29.71) 15.99,31.37 15.31,31.37 14.99,31.69 v3(14.99,32.89) 14.99,34.22 15.24,34.47 v3(16.85,34.47) 18.47,34.47 18.71,34.22 v3(18.71,32.89) 18.71,31.59 v3(18.57,31.44) ; v3(18.74,4.43) C50.1
  Top Layer w0.457: C8.1 42.85,46.8 v3(42.49,46.43) v3(40.73,46.43) 39.13,46.43 38.73,46.84 v3(38.73,48.77) 38.73,50.69 39.13,51.1 v3(40.73,51.1) v3(42.49,51.1) 42.85,50.73 C7.2 ; C18.2 44.44,34.48 v3(44.08,34.84) v3(42.32,34.84) 40.72,34.84 40.31,34.44 v3(40.31,32.51) 40.31,30.59 40.72,30.18 v3(42.32,30.18) v3(44.08,30.18) 44.44,30.55 C17.1
  Top Layer w0.508: v2(78.09,27.23) U14.3 ; D4.2 v2(10.15,28.75) ; USB1.12 v2(8.01,25.59) ; USB1.1 v2(8.01,31.91) ; v2(78.09,14.98) U15.3
  vias: v3(22.21,4.43) v3(23.63,4.48) v3(24.62,4.48) v3(27.29,4.48) v3(30.48,4.43) v3(31.9,4.48) v3(32.89,4.48) v3(35.56,4.48) v3(60.67,49.37) v3(60.67,48.64) v3(60.67,47.9) v3(60.67,30) v3(60.67,29.27) v3(60.67,28.53) v3(61.18,49.37) v3(61.18,48.64) v3(61.18,47.9) v3(61.18,30) v3(61.18,29.27) v3(61.18,28.53)
(no net):
  vias: v1(8.1,20.7) v1(8.1,17.4) v1(8.1,2.2) v1(9.3,20.7) v1(9.3,17.4) v1(9.3,2.2) v1(10.5,20.7) v1(10.5,17.4) v1(10.5,2.2)
CAN1_H: length 9.5
  Top Layer w0.254: F1.2 81.79,51.5 82.27,51.03 86.45,51.03 86.72,51.29 86.72,52.07 87.14,52.5 89.03,52.5
CAN1_L: length 8.4
  Top Layer w0.254: F2.2 81.79,50.2 82.27,50.67 86.94,50.67 87.61,50 89.5,50
CAN2_H: length 11.4
  Top Layer w0.254: 89.5,45 87.58,45 86.79,44.22 82.8,44.22 82.47,44.55 82.47,46.53 81.79,47.21 F3.2
CAN2_L: length 9.8
  Top Layer w0.254: F4.2 81.79,44.72 82.66,43.86 86.66,43.86 86.84,43.68 86.84,43.3 87.64,42.5 89.5,42.5
CAN_5V: length 35.4
  Top Layer w0.152: v3(71.65,49.89) 72.05,49.89 72.26,49.68 74.81,49.68 75.05,49.92 75.05,50.27 ; 67.39,51.77 66.27,51.77 66.08,51.96 66.08,55.38 66.27,55.58 67.39,55.58 ; 75.05,45.98 75.05,45.62 74.81,45.38 72.52,45.38 72.42,45.48 v3(72.03,45.48)
  Top Layer w0.254: v3(71.09,45.89) C13.1 ; v3(70.54,52.73) 70.55,52.74 70.55,53.83 C14.1 68.81,55.58 67.39,55.58 ; U1.3 v3(71.65,50.92) 71.27,50.92 C12.1 71.09,50.79 70.54,51.35 v3(70.54,51.85) ; v3(68.91,50.25) 68.42,50.25 C16.2 68.35,48.84 U4.4 ; v3(71.65,49.89) 70.3,49.89 v3(69.93,50.25) ; U2.3 v3(71.65,46.63) 71.21,46.63 71.03,46.45
  Bottom Layer w0.152: v3(72.03,45.48) 72.03,46.24 v3(71.65,46.63)
  Bottom Layer w0.254: v3(71.65,50.92) v3(71.65,49.89) ; 68.91,50.23 68.93,50.25 v3(69.93,50.25) ; v3(68.8,47.9) 68.94,47.76 70.77,47.76 70.96,47.57 70.96,46.02 v3(71.09,45.89) ; v3(70.54,51.85) v3(70.54,52.73)
  vias: v3(68.29,49.37) v3(68.29,48.64) v3(68.29,47.9) v3(68.8,49.37) v3(68.8,48.64)
CAN_G: length 27.5
  Top Layer w0.254: 73.65,51.58 v3(73.65,51.25) ; 73.65,51.58 U1.2 71.27,51.58 C12.2 ; 73.65,51.58 73.65,52.22 U1.8 ; 73.58,47.28 U2.2 71.21,47.28 71.03,47.45 ; 73.58,47.28 v3(73.58,46.95) ; 73.58,47.28 73.58,47.93 U2.8 ; v3(70.05,53.21) 68.94,54.32 C14.2 68.44,54.94 67.39,54.94 ; v3(66.79,50.18) C16.1 ; v3(66.22,51.13) 67.39,51.13
  Top Layer w0.508: v2(82.6,47.45) 89.45,47.45 89.5,47.5 ; v2(77.86,51.25) D1.3 ; v2(77.86,46.95) D2.3
  Bottom Layer w0.508: 78.99,47.45 v2(82.6,47.45)
  vias: v3(65.75,49.37) v3(65.75,48.64) v3(65.75,47.9) v3(66.26,49.37) v3(66.26,48.64) v3(66.26,47.9) v3(73.07,47.87) v3(73.07,46.03) v3(73.13,52.17) v3(73.13,50.33) v3(74.17,52.17) v3(74.17,50.33) v3(74.1,47.87) v3(74.1,46.03)
D_1.8V: length 28.9
  Top Layer w0.254: v3(26.46,2.61) 24.94,2.61 R39.2 C54.2
  Top Layer w0.381: P3.9 42.52,5.08 v3(41.53,6.07) ; v3(27.25,5.48) 28.44,5.48 32.26,9.29 39.17,9.29 v3(39.56,8.9)
  Bottom Layer w0.254: v3(27.25,5.48) 26.78,5.01 26.78,2.93 v3(26.46,2.61)
  Bottom Layer w0.381: P3.10 P3.9 ; v3(41.53,6.07) 41.53,6.93 v3(39.56,8.9)
D_3.3V: length 6.3
  Top Layer w0.381: R53.1 41.25,4.61 P3.7
  Bottom Layer w0.381: P3.8 P3.7
D_5V: length 6.1
  Top Layer w0.254: v3(24.6,3.53) U21.1 ; 23.68,5.43 22.84,5.43
  Top Layer w0.508: 22.84,5.43 C52.2 20.66,5.43
  Bottom Layer w0.254: v3(24.6,3.53) 24.13,4 24.13,4.97 v3(23.68,5.43)
HOST_USB_DM: length 9.8
  Top Layer w0.254: 14.15,28.43 12.53,28.43 12.38,28.58 12.38,29.22 11.9,29.7 11.39,29.7 10.93,29.24 10.05,29.24 9.59,29.7 8.99,29.7 8.79,29.5 v3(7.94,29.5) USB1.5 ; USB1.7 v3(7.94,28.5)
  Bottom Layer w0.254: v3(7.94,28.5) v3(7.94,29.5)
HOST_USB_DP: length 9.4
  Top Layer w0.254: USB1.6 8.11,29 8.37,28.74 8.37,28 ; 8.37,28 USB1.8 ; 8.37,28 8.57,27.8 D4.3 9.59,27.8 10.05,28.26 10.93,28.26 11.39,27.8 11.92,27.8 12.19,28.07 13.03,28.07 13.32,27.79 14.15,27.79
HUB1_USB_DM: length 33
  Top Layer w0.254: v3(21.47,54.13) 21.73,53.87 21.73,45.32 22.33,44.72 22.33,30.78 23.24,29.86 23.24,27.84 22.79,27.39 20.64,27.39 20.4,27.15 U19.10
  Bottom Layer w0.254: v3(21.47,54.13) 20.57,54.13 P4.12
HUB1_USB_DP: length 31.1
  Top Layer w0.254: P4.14 21.04,53.93 21.34,53.63 21.34,45.2 21.97,44.57 21.97,30.63 22.89,29.71 22.89,27.99 22.69,27.79 U19.11
J_3.3V: length 51.4
  Top Layer w0.254: 45.06,5.64 v3(77.37,5.64) ; D6.3 86.08,4.53 86.28,4.73 86.28,5.18 86.08,5.38 D6.4 85.33,5.38 84.77,5.93 79.66,5.93 v3(79.37,5.64)
  Top Layer w0.508: R52.1 43.94,8.22 45.06,7.11 P3.13
  Bottom Layer w0.254: v3(77.37,5.64) v3(79.37,5.64)
  Bottom Layer w0.508: P3.14 P3.13
J_5V: length 32.1
  Top Layer w0.508: R51.1 22.03,9.4 23.42,10.79 v2(39.85,10.79) ; v2(43.79,8.94) 43.79,9.27 v2(42.27,10.79) ; P3.11 v2(43.79,7.36)
  Bottom Layer w0.508: P3.12 P3.11 ; v2(43.79,8.94) v2(43.79,7.36) ; v2(39.85,10.79) v2(42.27,10.79)
J_LED_GREEN: length 27.9
  Top Layer w0.152: P3.29 57.14,4.5 R56.2
  Bottom Layer w0.152: P3.29 P3.30
J_LED_RED: length 29.6
  Top Layer w0.152: R57.2 81.03,5.41 80.38,4.76 56.12,4.76 P3.27
  Bottom Layer w0.152: P3.27 P3.28
LED_CAN1_RX: length 1.7
  Top Layer w0.152: R2.1 U23.17
LED_CAN1_TX: length 1.9
  Top Layer w0.152: U23.16 R1.1
LED_CAN2_RX: length 4.6
  Top Layer w0.152: R4.1 57.85,49.23 57.45,48.84 57.45,46.14 57.32,46.02 U23.38
LED_CAN2_TX: length 4.2
  Top Layer w0.152: U23.37 57.36,45.52 57.76,45.92 57.76,48.22 R3.1
LED_STATUS: length 1.7
  Top Layer w0.152: U23.51 53.23,54.47 R5.1
O_3.3V: length 135.3
  Top Layer w0.254: v2(44.29,9.94) 58.05,9.94 59.24,8.76 71.93,8.76 72.51,9.33 84.87,9.33 D5.4 86.08,8.78 86.28,8.58 86.28,8.13 86.08,7.93 D5.3
  Top Layer w0.508: v2(37.2,9.94) 23.66,9.94 v2(22.81,9.09) ; v1(10.5,7.4) v2(16.28,7.4) v2(16.28,14.14) ; P4.26 v2(28.66,36.07) ; v2(37.2,8.73) 37.7,8.22 R50.1 ; v2(28.66,33.64) 28.66,29.81 16.28,17.43 v2(16.28,15.94)
  Bottom Layer w0.254: v2(37.2,9.94) v2(44.29,9.94)
  Bottom Layer w0.508: v2(16.28,7.4) 21.12,7.4 v2(22.81,9.09) ; P4.25 P4.26 ; v2(28.66,36.07) v2(28.66,33.64) ; v2(16.28,14.14) v2(16.28,15.94) ; v2(37.2,8.73) v2(37.2,9.94)
  vias: v1(8.1,7.4) v1(9.3,7.4)
O_5V: length 63.2
  Top Layer w0.508: v2(18.19,15.3) R49.1 17.35,8.22 17.02,7.89 17.02,6.7 13.72,3.4 v1(10.5,3.4) ; v2(29.93,33.64) 29.93,29.91 v2(18.19,18.17) ; P4.28 v2(29.93,36.07)
  Bottom Layer w0.508: v2(18.19,18.17) v2(18.19,15.3) ; P4.27 P4.28 ; v2(29.93,36.07) v2(29.93,33.64)
  vias: v1(8.1,3.4) v1(9.3,3.4)
O_LED_GREEN: length 31.9
  Top Layer w0.152: P3.25 55.11,5.01 78.17,5.01 R54.2
  Bottom Layer w0.152: P3.25 P3.26
O_LED_RED: length 33.5
  Top Layer w0.152: P3.23 54.09,5.27 77.53,5.27 R55.2
  Bottom Layer w0.152: P3.24 P3.23
O_VOUT: length 54.6
  Top Layer w0.508: P4.30 v2(31.2,36.07) ; v2(31.2,33.64) 31.2,29.98 12.63,11.4 v1(10.5,11.4)
  Bottom Layer w0.508: v2(31.2,36.07) v2(31.2,33.64) ; P4.29 P4.30
  vias: v1(8.1,11.4) v1(9.3,11.4)
R_3.3V: length 34
  Top Layer w0.152: 2.85,37.05 2.85,36.95 3.61,36.19 15.48,36.19 20.96,41.67 v3(20.96,42.18)
  Top Layer w0.254: C45.2 25.88,48.08 25.24,47.44 U18.13 23.56,47.44 23.12,47 v3(23.12,46.5) ; v3(23.12,44.9) 24.28,44.9 24.28,44.08 24.67,43.69 C46.1
  Bottom Layer w0.152: v3(23.12,44.9) 23.12,44.34 v3(20.96,42.18)
  Bottom Layer w0.254: v3(23.12,44.9) v3(23.12,46.5)
R_CD: length 5
  Top Layer w0.254: 20.61,52.49 19.93,52.49 R34.1 19.05,51.62 CARD1.CD
R_USB_DM: length 12.1
  Top Layer w0.254: v3(22.21,53.28) 22.57,53.28 25.37,50.47 25.37,49.54 25.17,49.34 24.29,49.34 U18.16
  Bottom Layer w0.254: P4.8 17.96,54.2 18.73,54.2 19.65,53.28 v3(22.21,53.28)
R_USB_DP: length 12
  Top Layer w0.254: v3(22.48,53.7) 22.65,53.7 25.73,50.62 25.73,49.4 25.05,48.71 U18.15
  Bottom Layer w0.254: v3(22.48,53.7) 19.72,53.7 P4.10
RS232_RXD: length 9.3
  Top Layer w0.254: 89.5,22.5 87.43,22.5 85.35,24.58 82.93,24.58 81.79,25.71 F5.2
RS232_TXD: length 9.3
  Top Layer w0.254: F6.2 81.79,28.26 83.03,27.02 85.45,27.02 87.46,25 89.5,25
RS485_5V: length 36.1
  Top Layer w0.178: C40.1 75.08,42.81 75.52,43.25 77.53,43.25 R30.2 ; R32.2 77.53,38.03 75.52,38.03 75.08,37.59 C41.1
  Top Layer w0.254: U12.8 v3(75.02,42.02) C40.1 ; C31.2 68.35,29.47 NOREF.1 ; C31.2 67.84,31.42 66.27,31.42 66.01,31.67 66.01,32.09 66.52,32.6 66.52,36.19 66.69,36.36 U7.16 68.91,36.36 69.04,36.23 ; C31.2 71.52,30.91 v3(74.62,34.01) ; v3(74.62,39.24) 74.62,37.93 74.96,37.59 C41.1 v3(75.02,36.8) U13.8
  Bottom Layer w0.254: v3(74.62,34.01) 74.62,36.39 v3(75.02,36.8) ; v3(74.62,39.24) 74.62,41.62 v3(75.02,42.02)
  vias: v3(68.29,30) v3(68.29,29.27) v3(68.29,28.53) v3(68.8,30) v3(68.8,29.27) v3(68.8,28.53)
RS485_A1: length 8.6
  Top Layer w0.254: F10.2 81.79,41.64 82.62,40.82 86.74,40.82 87.55,40 89.5,40
RS485_A2: length 14.4
  Top Layer w0.254: 89.5,32.5 87.7,32.5 86.94,31.74 86.94,30.93 86.63,30.62 82.89,30.62 82.47,31.04 82.47,34.97 81.79,35.65 F12.2
RS485_B1: length 10.5
  Top Layer w0.254: F9.2 81.79,39.67 82.58,40.46 86.3,40.46 86.67,40.09 86.67,39.62 86.95,39.33 86.95,38.19 87.64,37.5 89.5,37.5
RS485_B2: length 11.2
  Top Layer w0.254: 89.5,30 89.24,30.26 82.74,30.26 82.12,30.89 82.12,32.89 81.79,33.21 F11.2
RS485_G: length 20
  Top Layer w0.254: v3(74.13,39.74) 74.19,39.68 U12.5 ; v3(66.44,31.91) U7.9 ; v3(78.53,38.48) R31.1 ; U13.5 74.19,34.45 v3(74.13,34.51) ; v3(69.6,35.22) C33.2 ; v3(66.79,30.91) C31.1 ; v3(73.46,42.81) C40.2 ; v3(73.46,37.59) C41.2 ; v3(78.53,33.27) R33.1
  Top Layer w0.508: v2(79.75,38.04) 82.08,38.04 82.87,37.26 86.35,37.26 87.6,36.01 87.6,35.51 88.11,35 89.5,35 ; v2(77.86,40.66) U16.3 ; v2(78.09,35.43) U17.3
  Bottom Layer w0.508: 79.2,38.04 v2(79.75,38.04)
  vias: v3(65.75,30) v3(65.75,29.27) v3(65.75,28.53) v3(66.26,30) v3(66.26,29.27) v3(66.26,28.53) v3(73.09,41.57) v3(73.09,39.74) v3(73.09,36.34) v3(73.09,34.51) v3(73.61,40.66) v3(73.61,35.43) v3(74.13,41.57) v3(74.13,36.34)
U_3.3V: length 154.6
  Top Layer w0.152: 85.46,35.55 85.21,35.8 v3(84.84,35.8) ; v3(84.84,32.4) 85.21,32.4 85.46,32.15 ; 85.46,25.35 85.21,25.6 v3(84.84,25.6) ; v3(84.84,39.2) 85.21,39.2 85.46,38.95 ; 85.46,28.75 85.21,29 v3(84.84,29)
  Top Layer w0.254: 72.03,14 U10.1 71.1,14 C34.2 ; 72.03,14 72.97,14.93 74.32,14.93 76.54,17.14 76.54,22.48 ; 72.03,14 72.03,13.35 ; 73.01,13.35 72.03,13.35 ; 72.03,13.35 72.03,12.26 71.19,11.42 U11.1 71.1,11.42 C35.2 69.98,11.54 v3(69.98,12.09) ; 73.63,23.59 75.42,23.59 76.54,22.48 ; C20.2 44.42,28.42 45.73,27.11 45.73,20.97 43.94,19.18 43.94,17.65 v3(44.5,17.09) 44.71,16.88 49.11,16.88 51.24,14.75 55.8,14.75 v3(57.05,13.5) ; U9.16 C36.1 46.02,18.33 45.5,17.81 v3(45.23,17.81) ; 47.73,33.34 47.73,34.86 U6.48 47.73,36.29 ; 47.73,33.34 47.73,29.66 47.43,29.37 U6.9 45.38,29.37 44.44,28.42 ; 47.73,33.34 52.16,33.34 v3(52.18,33.37) 52.43,33.12 52.43,32.68 52.93,32.18 52.93,27.38 53.23,27.07 U6.24 53.23,24.95 ; v3(84.84,25.6) 84.06,26.38 82.98,26.38 82.37,26.99 81.25,26.99 80.95,26.69 80.95,25.04 80.52,24.61 C19.2 U5.20 77.65,23.59 76.54,22.48 ; 85.46,15.15 85.46,21.95 85.45,21.95 v3(84.84,21.95) ; v3(59.86,36.12) 60.31,36.12 C25.2 60.55,36.36 U7.1 ; v3(53.69,33.37) U6.36 56.14,33.37 ; v3(59.07,35.34) 58.21,35.34 56.23,33.37 ; R8.2 44.28,28.42 ; v3(69.2,12.09) 68.42,12.09 67.77,12.74 67.77,13.79 67.39,14.17 v3(61.32,14.17)
  Top Layer w0.381: v3(43.71,16.3) 41.7,14.28 R48.1
  Bottom Layer w0.254: 69.2,12.07 69.23,12.09 v3(69.98,12.09) ; v3(45.23,17.81) v3(44.5,17.09) v3(43.71,16.3) ; v3(57.05,13.5) 57.05,13.51 58.98,13.51 59.36,13.89 59.36,14.25 59.79,14.67 60.81,14.67 v3(61.32,14.17) ; v3(84.84,39.2) 85,39.04 85,22.1 v3(84.84,21.95) ; v3(59.07,35.34) 59.83,36.1 59.86,36.1 ; v3(52.18,33.37) v3(53.69,33.37)
U_5V: length 71.2
  Top Layer w0.254: R47.1 20.75,9.8 24.26,13.3 v3(39.85,13.3) ; v3(55.42,14.31) 57.1,12.64 57.1,10.99 57.43,10.66 v3(59.74,10.66) ; v3(57.23,19.73) 57.23,28.77 59.05,30.6 61.48,30.6 62.08,30 v3(63.21,30) 63.27,30.06 C26.2 ; v3(42.32,13.3) v3(54.41,13.3) ; v3(60.68,10.66) C42.1 60.75,11.22 61.1,11.56 U24.8
  Bottom Layer w0.254: v3(57.23,19.73) 55.42,17.93 v3(55.42,14.31) v3(54.41,13.3) ; v3(60.68,10.66) v3(59.74,10.66) ; v3(39.85,13.3) v3(42.32,13.3)
  vias: v3(63.21,29.27) v3(63.21,28.53) v3(63.72,30) v3(63.72,29.27) v3(63.72,28.53)
U_RST: length 4.7
  Top Layer w0.152: R8.1 43.93,29.77 42.92,29.77 42.47,29.32 C22.2
  Top Layer w0.254: R8.1 44.44,29.31 45.49,30.37 U6.7
U_USB_DM: length 46.7
  Top Layer w0.254: 14.15,27.15 14.96,27.15 16.1,26 22.12,26 23.8,27.68 23.8,32.33 26.01,34.54 33.89,34.54 36.09,36.74 45.13,36.74 46.59,38.19 48.23,38.19 50.73,35.69 U6.42
U_USB_DP: length 45.9
  Top Layer w0.254: 14.15,26.51 15.09,26.51 15.96,25.65 22.27,25.65 24.16,27.53 24.16,32.18 26.16,34.18 34.04,34.18 36.23,36.38 45.28,36.38 46.74,37.84 48.08,37.84 50.23,35.69 U6.43
U_VBUS: length 20.2
  Top Layer w0.254: R42.1 10.05,31.03 9.57,31.51 8.36,31.51 v2(7.96,31.11) ; v2(7.96,26.39) 8.36,25.99 9.57,25.99 10.05,26.47 R41.1
  Top Layer w0.482: v2(7.38,24.73) U22.1
  Top Layer w0.508: USB1.11 v2(7.96,26.39) ; D4.5 v2(10.78,28.75) ; USB1.2 v2(7.96,31.11)
  Bottom Layer w0.508: v2(7.96,31.11) 7.38,30.53 7.38,26.39 ; v2(10.78,28.75) 10.78,28.41 8.77,26.39 v2(7.96,26.39) 7.38,26.39 ; 7.38,26.39 v2(7.38,24.73)
U_VIO: length 24.3
  Top Layer w0.152: R28.1 67.74,9.85 67.16,9.27 62.72,9.27 61.83,10.15 60.55,10.15 60.17,10.53 60.17,11.7 59.77,12.1 R24.1
  Top Layer w0.178: 74.5,11.94 74.5,13.53 74.04,13.99 ; 74.5,11.94 75.28,11.94 75.9,11.31 R29.1 ; 74.5,11.94 C38.2
  Top Layer w0.254: C39.2 67.97,10.01 R28.1 67.85,9.85 68.15,9.54 71.77,9.54 72.06,9.83 72.06,10.65 72.83,11.42 73.97,11.42 C38.2 ; 73.01,14 74,14 C37.2
U_VREF_PWM: length 15.2
  Top Layer w0.152: v3(53.63,6.08) 54.26,6.08 v3(57.67,9.49) ; P3.21 v3(52.74,5.19) ; v3(57.67,11.11) 57.67,12.1 57.67,12.1 R19.1 R20.1
  Bottom Layer w0.152: v3(57.67,9.49) v3(57.67,11.11) ; P3.21 P3.22 ; v3(52.74,5.19) v3(53.63,6.08)
U_XI: length 6.4
  Top Layer w0.254: 41.44,33.61 42.37,32.68 44.11,32.68 C18.1 44.52,33.01 44.92,32.61 44.92,31.91 45.46,31.37 U6.5
U_XO: length 3.8
  Top Layer w0.254: 43.19,31.41 43.79,32.01 C17.2 44.44,31.89 45.46,30.87 U6.6
UART0_RTC: length 11.3
  Top Layer w0.152: U6.39 R17.2 53.21,36.31 53.8,35.72 U7.2
UART0_RTC1: length 9.8
  Top Layer w0.152: 71.63,40.33 71.63,39.34 71.94,39.02 71.94,37.39 70.28,35.72 U7.15 ; 71.63,40.33 U12.3 ; 71.63,40.33 71.63,40.86 71.74,40.98 U12.2
UART0_RXD: length 52.4
  Top Layer w0.152: U7.6 v3(59.63,33.18) ; 73.63,22.29 74.68,22.29 75.7,21.27 75.7,17.12 74.55,15.97 73,15.97 71.83,14.8 58.19,14.8 58.07,14.68 v3(57.61,14.68) ; v3(58.29,32.76) 56.4,30.87 U6.31 54.09,30.87 53.8,30.58 53.8,27.68 56.82,24.67 56.82,18.06 v3(57.18,17.69)
  Bottom Layer w0.152: v3(58.29,32.76) 58.72,33.18 v3(59.63,33.18) ; v3(57.61,14.68) 57.18,15.1 v3(57.18,17.69)
UART0_RXD1: length 12.1
  Top Layer w0.152: U12.1 71.71,41.63 71.27,41.19 71.27,39.16 71.56,38.87 v3(71.56,37.56) ; v3(71.04,35.55) v3(70.33,34.84) ; v3(70.33,33.82) 69.7,33.18 U7.11
  Bottom Layer w0.152: 71.04,35.55 71.04,36.12 71.56,36.65 v3(71.56,37.56) ; v3(70.33,34.84) v3(70.33,33.82)
UART0_TXD: length 52.7
  Top Layer w0.152: U7.3 61.24,35.09 60.51,34.36 59.64,34.36 58.69,33.41 58.69,32.61 v3(56.94,30.86) 56.44,30.37 U6.30 ; 73.63,22.94 73.66,22.92 74.71,22.92 75.95,21.68 75.95,16.99 74.68,15.72 73.1,15.72 71.93,14.55 59.82,14.55 59.69,14.42 v3(58.42,14.42) ; v3(57.69,28.55) v3(57.69,17.7)
  Bottom Layer w0.152: v3(56.94,30.86) 57.69,30.11 v3(57.69,28.55) ; v3(58.42,14.42) 57.69,15.16 v3(57.69,17.7)
UART0_TXD1: length 8.2
  Top Layer w0.152: U12.4 72.2,37.28 69.66,34.74 68.6,34.74 68.26,35.09 U7.14
UART1_RTC: length 20.9
  Top Layer w0.152: v3(52.49,28.85) 50.94,28.85 50.23,28.14 U6.18 R18.2 ; v3(55.84,28.85) 56.8,28.85 59.39,31.44 62.65,31.44 62.9,31.7 62.9,34.06 62.51,34.45 U7.4
  Bottom Layer w0.152: v3(52.49,28.85) v3(55.84,28.85)
UART1_RTC1: length 6
  Top Layer w0.152: 71.63,35.1 70.98,34.45 U7.13 ; 71.63,35.1 71.63,35.63 71.74,35.75 U13.2 ; 71.63,35.1 U13.3
UART1_RXD: length 64.8
  Top Layer w0.152: U7.7 59.88,32.55 56.7,29.36 v3(55.84,29.36) ; v3(52.49,29.36) 49.29,29.36 47.73,27.8 U6.13 47.73,25.5 46.29,24.05 46.29,20.74 44.5,18.95 44.5,18 45.07,17.44 49.35,17.44 51.47,15.31 71.62,15.31 72.79,16.48 74.34,16.48 75.19,17.33 75.19,20.45 74.65,20.99 73.63,20.99
  Bottom Layer w0.152: v3(52.49,29.36) v3(55.84,29.36)
UART1_RXD1: length 7.4
  Top Layer w0.152: U13.1 71.79,36.4 71.42,36.03 v3(71.42,35.97) ; v3(71.42,34) 69.97,32.55 U7.10
  Bottom Layer w0.152: v3(71.42,35.97) v3(71.42,34)
UART1_TXD: length 68.6
  Top Layer w0.152: 73.63,21.64 74.68,21.64 75.44,20.88 75.44,17.23 74.44,16.22 72.89,16.22 71.72,15.06 51.37,15.06 49.24,17.18 44.96,17.18 44.25,17.9 44.25,19.06 46.03,20.84 46.03,27.87 U6.12 47.31,27.87 49.31,29.87 v3(52.49,29.87) ; v3(55.84,29.87) 56.57,29.87 59.11,32.41 59.11,33.33 59.6,33.82 U7.5
  Bottom Layer w0.152: v3(52.49,29.87) v3(55.84,29.87)
UART1_TXD1: length 4.9
  Top Layer w0.152: U13.4 71.34,34.45 71.09,34.2 69.99,34.2 69.61,33.82 U7.12
UART2_RXD: length 41.8
  Top Layer w0.152: 49.78,22.92 50.05,23.19 50.66,23.19 52.23,24.77 U6.22 ; 49.78,22.92 50.11,22.58 50.11,17.39 51.68,15.82 71.41,15.82 72.58,16.99 74.13,16.99 74.68,17.54 74.68,19.6 74.59,19.69 73.63,19.69 ; 49.78,22.92 U9.9
UART2_TXD: length 46.8
  Top Layer w0.152: U6.21 51.73,24.63 50.56,23.45 49.92,23.45 49.79,23.31 46.79,23.31 46.54,23.07 46.54,22.58 46.85,22.27 U9.10 49.35,22.27 49.86,21.76 49.86,17.28 51.58,15.56 71.51,15.56 72.68,16.73 74.23,16.73 74.94,17.44 74.94,20.05 74.64,20.34 73.63,20.34
UART3_RXD: length 54.9
  Top Layer w0.152: R23.1 69.16,10.12 69.6,10.57 69.6,13.01 v3(70.05,13.45) ; U6.38 52.73,32.81 53.23,32.31 53.23,27.5 53.73,27 53.73,24.58 53.58,24.43 52.7,24.43 50.37,22.1 50.37,17.49 51.79,16.07 71.3,16.07 72.09,16.86 72.09,18.02 v3(72.47,18.39) 73.63,18.39
  Bottom Layer w0.152: v3(70.05,13.45) 72.08,15.49 72.08,18.01 v3(72.47,18.39)
UART3_TXD: length 53.1
  Top Layer w0.152: 73.63,19.04 v3(72.47,19.04) 71.83,18.41 71.83,16.96 71.2,16.33 51.89,16.33 50.62,17.6 50.62,21.99 52.02,23.39 53.57,23.39 53.98,23.8 53.98,27.12 53.55,27.56 53.55,32.45 53.23,32.77 U6.37 ; R22.1 69.1,13.04 v3(69.53,13.47)
  Bottom Layer w0.152: v3(69.53,13.47) 71.83,15.77 71.83,18.41 v3(72.47,19.04)
UART_RXD: length 8.2
  Top Layer w0.254: F8.2 86.3,13.73 87.57,15 89.5,15
UART_TXD: length 10.8
  Top Layer w0.254: F7.2 81.79,15.96 83.44,14.32 85.95,14.32 86.31,14.67 86.31,16.15 87.66,17.5 89.5,17.5
V_3.3V: length 141.8
  Top Layer w0.152: 85.45,52.55 85.2,52.8 v3(84.84,52.8) ; 85.45,45.75 85.2,46 v3(84.84,46) ; 85.45,49.15 85.2,49.4 v3(84.84,49.4) ; 56.98,54.91 58.34,54.91 v3(58.94,54.31) ; v3(84.84,42.6) 85.2,42.6 85.45,42.35 ; 63.4,54.98 63.4,51.96 63.2,51.77 U3.7
  Top Layer w0.254: v3(48.29,39.84) C2.1 U23.19 v4(47.73,42.9) 53.94,42.9 54.23,42.61 U23.32 C3.2 ; P1.1 39.87,52.23 42.25,52.23 42.79,51.69 C1.2 42.89,51.69 43.57,51.02 U23.1 v3(45.95,51.02) 46.58,50.39 46.58,45.36 v4(46.23,45.02) U23.13 42.92,45.02 C5.2 ; U23.64 v3(46.73,51.8) 47.51,51.02 54.76,51.02 54.84,50.94 55.19,50.94 55.27,51.02 U23.48 C4.2 57.93,52.02 ; v3(63.39,55.01) 62.82,55.58 U3.1 62.08,55.58 C11.2 60.44,55.58 60.01,55.15 60.01,54.78 59.54,54.31 R6.2 v3(58.94,54.31) ; v3(58.94,53.44) R7.2
  Top Layer w0.381: v3(46.63,37.08) 46.63,36.41 45.75,35.53 39.22,35.53 38.86,35.17 38.86,29.33 40.42,27.77 R46.1
  Bottom Layer w0.254: v3(63.39,55.01) 64.25,55.87 83.84,55.87 84.84,54.88 v3(84.84,52.8) 84.99,52.64 84.99,42.76 v3(84.84,42.6) ; v3(45.95,51.02) v3(46.73,51.8) ; v4(47.73,42.9) 47.73,43.51 v4(46.23,45.02) ; v3(57.93,52.03) 57.93,52.43 v3(58.94,53.44) v3(58.94,54.31)
  Bottom Layer w0.381: v3(48.29,39.84) 46.63,38.19 v3(46.63,37.08)
V_5V: length 77.6
  Top Layer w0.254: R45.1 19.47,9.25 24.05,13.84 33.17,13.84 34.52,15.18 34.52,32.02 38.52,36.03 v3(45.55,36.03) ; v3(49.07,38.09) 54.58,38.09 58.39,41.9 58.39,47.46 58.76,47.82 59.31,47.82 60.12,48.63 60.12,49.78 61.04,50.69 62.75,50.69 C15.2 63.27,48.84 U4.2
  Bottom Layer w0.254: v3(49.07,38.09) 47,36.03 v3(45.55,36.03)
  vias: v3(63.21,49.37) v3(63.21,48.64) v3(63.21,47.9) v3(63.72,49.37) v3(63.72,48.64) v3(63.72,47.9)
V_CAN1_RX: length 15.9
  Top Layer w0.152: U3.5 61.37,53.04 61.03,52.7 56.36,52.7 v3(55.8,52.14) ; v3(55.02,51.36) 48.78,51.36 48.23,51.91 U23.61
  Bottom Layer w0.152: v3(55.02,51.36) 55.03,51.36 v3(55.8,52.14)
V_CAN1_RX1: length 6.8
  Top Layer w0.152: 72.25,50.27 72.24,50.27 70.63,50.27 70.15,50.74 70.15,52.09 69.21,53.04 67.39,53.04
V_CAN1_TX: length 17.4
  Top Layer w0.152: U3.3 60.5,54.31 ; U23.62 47.73,54.15 49.12,55.54 55.99,55.54 56.24,55.29 56.24,54.54 56.89,53.88 60.01,53.88 60.44,54.31 R6.1
V_CAN1_TX1: length 5.7
  Top Layer w0.152: U1.1 71.42,52.22 71.42,52.23 70.5,52.23 68.78,53.94 68.53,53.94 68.16,54.31 67.39,54.31
V_CAN2_RX: length 13.3
  Top Layer w0.152: U3.6 56.73,52.4 56.07,51.74 50.38,51.74 50.23,51.9 U23.57
V_CAN2_RX1: length 9.6
  Top Layer w0.152: v3(70.74,48.25) 69.28,49.71 69.28,51.89 68.77,52.4 67.39,52.4 ; v3(71.6,45.98) U2.4
  Bottom Layer w0.152: v3(70.74,48.25) 71.27,47.72 71.27,46.31 v3(71.6,45.98)
V_CAN2_TX: length 15.3
  Top Layer w0.152: U3.4 60.82,53.67 60.58,53.44 R7.1 60.07,53.01 55.95,53.01 54.77,54.19 53.7,54.19 53.57,54.33 53.57,54.93 53.44,55.06 50.62,55.06 49.73,54.17 U23.58
V_CAN2_TX1: length 8.7
  Top Layer w0.152: 67.39,53.67 68.52,53.67 v3(68.76,53.44) ; U2.1 71.6,47.93 69.54,49.99 69.54,52.17 v3(69.06,52.65)
  Bottom Layer w0.152: v3(69.06,52.65) 69.06,53.14 v3(68.76,53.44)
V_RST: length 12.6
  Top Layer w0.152: v3(46.1,49.8) 46.1,48.18 45.94,48.02 U23.7 43.58,48.02 43.43,47.86 43.43,46.37 42.91,45.85 C10.1
  Bottom Layer w0.152: P1.5 43.56,50.64 44.4,49.8 v3(46.1,49.8)
V_SWC: length 15.5
  Top Layer w0.152: v3(52.33,50.5) 47.42,50.5 45.45,52.47 43.44,52.47 P1.4 ; U23.49 v3(54.84,53.01)
  Bottom Layer w0.152: v3(54.84,53.01) v3(52.33,50.5)
V_SWD: length 16.7
  Top Layer w0.152: P1.3 41.96,52.68 42.6,52.68 43.06,52.22 45.34,52.22 47.55,50.02 U23.46
V_USB_DM: length 52.9
  Top Layer w0.254: U23.35 48.35,44.52 41.16,37.33 35.89,37.33 33.73,35.18 22.88,35.18 v3(22.8,35.1) ; v3(21.19,35.1) 21.11,35.18 14.63,35.18 12.93,33.47 12.93,29.87 13.08,29.71 14.15,29.71
  Bottom Layer w0.254: v3(22.8,35.1) 22.72,35.18 21.27,35.18 v3(21.19,35.1)
V_USB_DP: length 54.2
  Top Layer w0.254: v3(22.8,35.6) 22.88,35.53 33.59,35.53 35.74,37.69 41.02,37.69 48.22,44.89 55.21,44.89 55.33,45.02 U23.36 ; 14.15,29.07 13.22,29.07 12.57,29.72 12.57,33.62 14.49,35.53 21.11,35.53 v3(21.19,35.6)
  Bottom Layer w0.254: v3(22.8,35.6) 22.73,35.53 21.26,35.53 v3(21.19,35.6)
$1N3069: length 2
  Top Layer w0.254: R41.2 9.03,26.47 8.5,27 USB1.10
$1N3071: length 2.2
  Top Layer w0.254: USB1.4 8,30 9.03,31.03 R42.2
$1N5971: length 1.9
  Top Layer w0.152: R54.1 83.95,7.9 D5.2
$1N5973: length 1.9
  Top Layer w0.152: D5.1 83.95,8.81 R55.1
$1N6094: length 1.9
  Top Layer w0.152: R57.1 83.95,5.41 D6.1
$1N6096: length 1.9
  Top Layer w0.152: D6.2 83.95,4.5 R56.1
$1N11841: length 3.1
  Top Layer w0.254: C54.1 R39.1 R40.2 22.81,2.46 22.81,3.53
$1N12310: length 3.1
  Top Layer w0.254: 31.08,3.53 31.08,2.46 R38.2 R37.1 C53.1
$1N17961: length 1.2
  Top Layer w0.254: R44.2 9.29,22.8 U22.3
$1N17962: length 1.4
  Top Layer w0.254: R43.1 12.34,22.83 11.62,22.83
$3N2411: length 8.1
  Top Layer w0.254: U12.6 75.56,40.33 76.03,40.8 76.03,41.36 U16.1 ; U16.1 76.27,42.21 76.87,42.81 R30.1 ; U16.1 76.51,41.6 76.93,41.18 79.61,41.18 80.09,41.67 F10.1
$3N2413: length 8.2
  Top Layer w0.152: v3(75.61,40.98) U12.7
  Top Layer w0.254: 76.97,38.5 76.87,38.5 76.27,39.1 U16.2 ; F9.1 80.09,39.64 79.61,40.13 76.93,40.13 76.51,39.7 U16.2 ; U16.2 v3(76.27,40.43)
  Bottom Layer w0.254: v3(76.27,40.43) 75.73,40.98 v3(75.61,40.98)
$3N2949: length 8.1
  Top Layer w0.254: U13.6 75.56,35.1 76.03,35.57 76.03,36.14 76.27,36.38 ; 76.97,37.58 76.87,37.58 76.27,36.98 76.27,36.38 ; 76.27,36.38 76.51,36.38 76.93,35.95 79.61,35.95 80.09,36.44 F12.1
$3N2961: length 8.2
  Top Layer w0.152: v3(75.61,35.75) U13.7
  Top Layer w0.254: F11.1 80.09,34.41 79.61,34.9 76.93,34.9 76.51,34.48 76.27,34.48 ; 76.27,34.48 v3(76.27,35.2) ; 76.27,34.48 76.27,33.87 76.87,33.27 76.97,33.27
  Bottom Layer w0.254: v3(75.61,35.75) 75.73,35.75 v3(76.27,35.2)
$3N6150: length 1.5
  Top Layer w0.254: C27.1 54.86,18.37 U9.1
$3N6154: length 6.4
  Top Layer w0.254: U9.3 52.6,19.67 52.18,19.25 52.18,18.21 52.53,17.85 55.34,17.85 C27.2
$3N6187: length 2.8
  Top Layer w0.254: U9.4 54.03,20.32 54.16,20.19 55.32,20.19 C29.1
$3N6191: length 1.6
  Top Layer w0.254: C29.2 54.62,20.97 U9.5
$3N6279: length 1.6
  Top Layer w0.254: C28.1 54.63,19.02 U9.2
$3N6283: length 1.5
  Top Layer w0.254: U9.6 C30.1
$3N18347: length 45
  Top Layer w0.254: U9.7 52.3,22.27 51.56,21.53 51.56,17.95 52.25,17.27 70.81,17.27 71.07,17.52 71.07,26.38 72.24,27.55 75.62,27.55 76.24,28.18 76.69,28.18 77.11,27.76 79.78,27.76 80.27,28.24 80.27,28.48
$3N18365: length 46.4
  Top Layer w0.254: U9.8 52.24,22.92 51.11,21.79 51.11,17.8 52.07,16.83 70.98,16.83 71.53,17.38 71.53,26.21 72.22,26.9 75.62,26.9 76.24,26.28 76.69,26.28 77.11,26.7 79.78,26.7 80.27,26.21 80.27,25.98
